# Altium schematic sheet sheet2.SchDoc
size A4; DrawnBy: M.A. Nusrath Amana; SheetNumber: 2; SheetTotal: 1
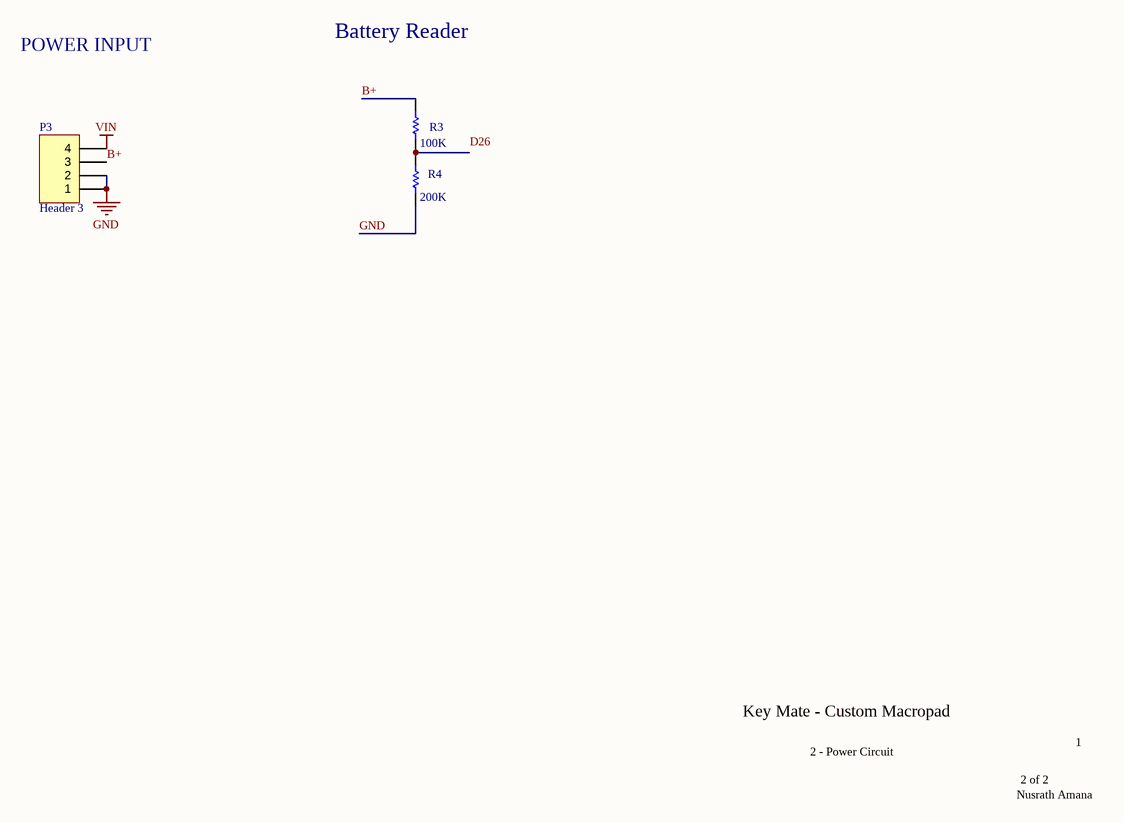
[diagram p0: sheet2.SchDoc]

## Parts
P3  Header 3  [HDR1X4]
R3  value 100K  [AXIAL-0.3]  (hidden comment: Res1)
R4  value 200K  [AXIAL-0.3]  (hidden comment: Res1)

## Nets
GND: P3.1 P3.2 R4.1
VIN: P3.4
B+: P3.3 R3.2
NetR3_1: R3.1 R4.2

## Notes on the sheet
- Battery Reader
- POWER INPUT
- Key Mate - Custom Macropad
- 2 - Power Circuit
- 2 of 2
- 1
- Nusrath Amana
- Labels drawn without touching a wire or pin: D26

## Library data of the parts
P3 = Header 4: Header, 4-Pin; LatestRevisionDate: 17-Jul-2002; LatestRevisionNote: Re-released for DXP Platform.; Publisher: Altium Limited
R3 R4 = Res1: Resistor; Published: 8-Jun-2000; LatestRevisionDate: 17-Jul-2002; LatestRevisionNote: Re-released for DXP Platform.; PackageReference: AXIAL-0.3; Publisher: Altium Limited; PackageDescription: Axial Device, Thru-Hole; 2 Leads; 0.3 in Pin Spacing